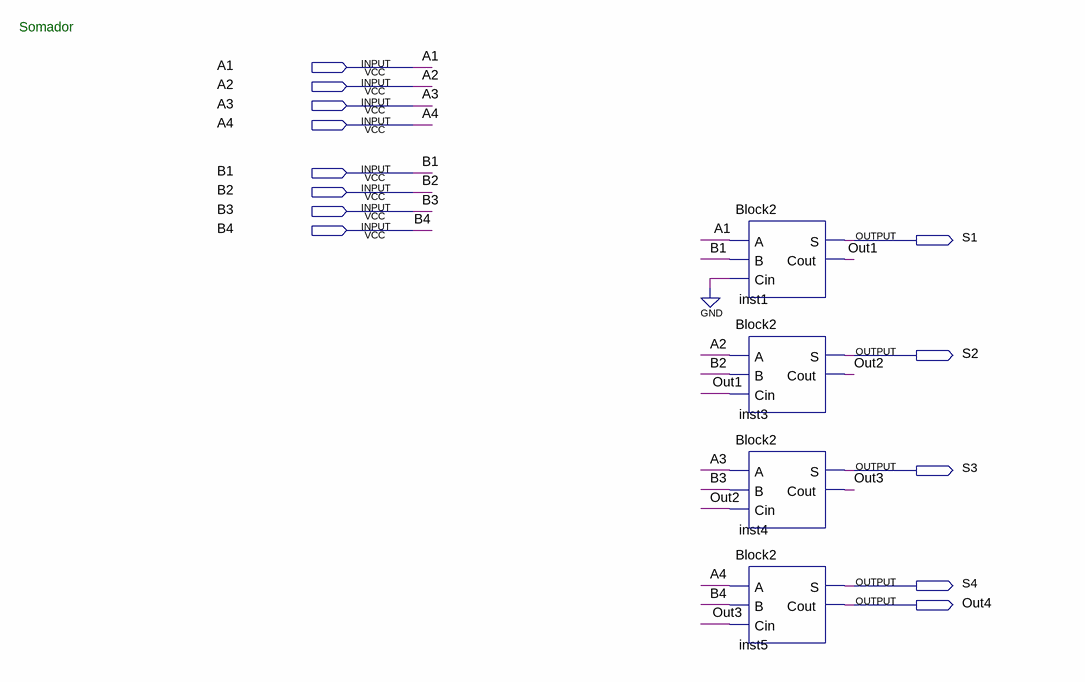
[diagram p0: schematic sheet]
// Quartus schematic aula6.bdf as structural Verilog: 4 symbols, 13 pins
module aula6 (
  input  A1,
  input  A2,
  input  A3,
  input  A4,
  input  B1,
  input  B2,
  input  B3,
  input  B4,
  output S1,
  output S2,
  output S3,
  output S4,
  output Out4
);

  wire Out1, Out2, Out3;

  Block2 inst1 (.A(A1), .B(B1), .Cin(1'b0), .S(S1), .Cout(Out1));
  Block2 inst3 (.A(A2), .B(B2), .Cin(Out1), .S(S2), .Cout(Out2));
  Block2 inst4 (.A(A3), .B(B3), .Cin(Out2), .S(S3), .Cout(Out3));
  Block2 inst5 (.A(A4), .B(B4), .Cin(Out3), .S(S4), .Cout(Out4));

  // Notes on the sheet:
  //   Somador
endmodule
